# Altium schematic sheet Adafruit PyGamer_1.SchDoc
size 442 x 288 mm; COMPANY: ADAFRUIT INDUSTRIES; DRAWN: KTOWN; REV: B; Origin: Eagle
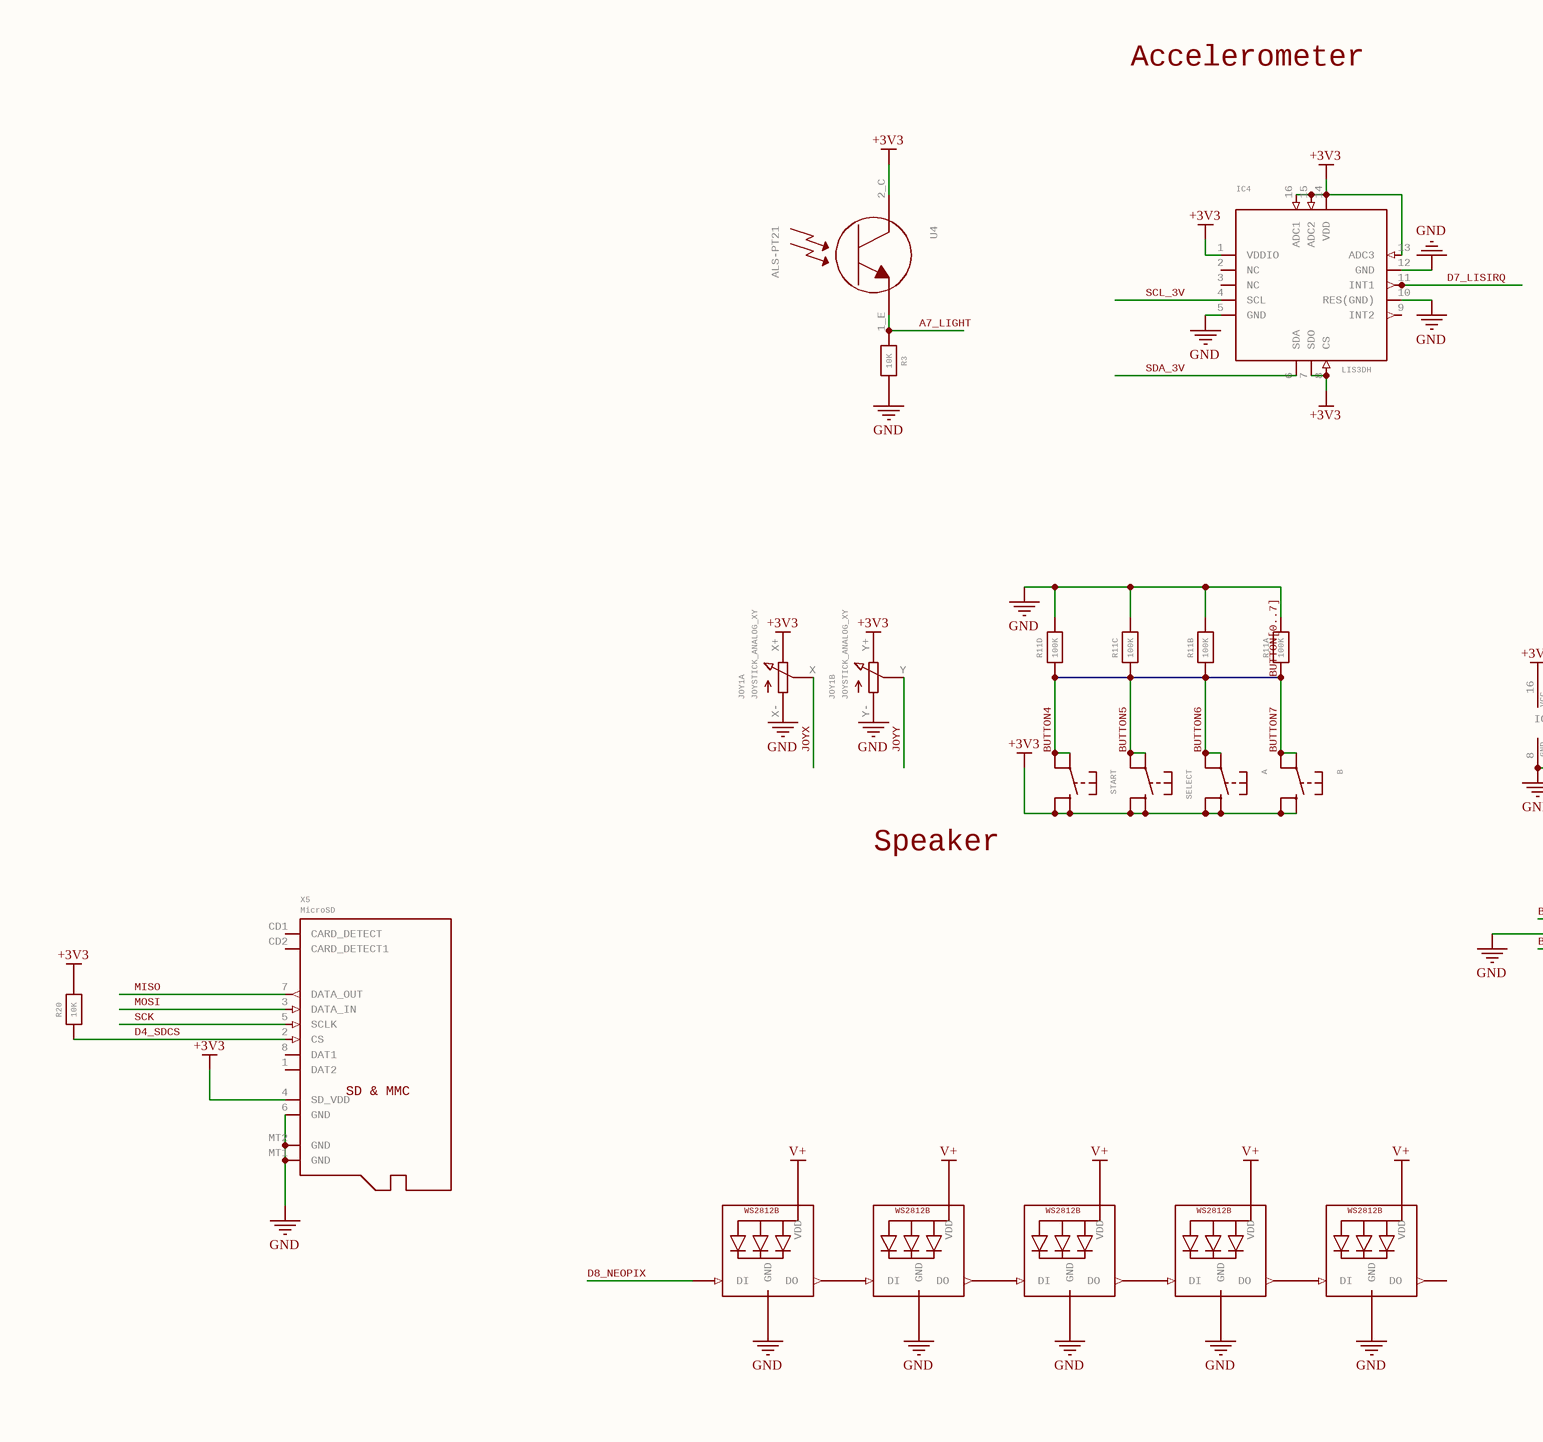
[diagram p0: Adafruit PyGamer_1.SchDoc, left]
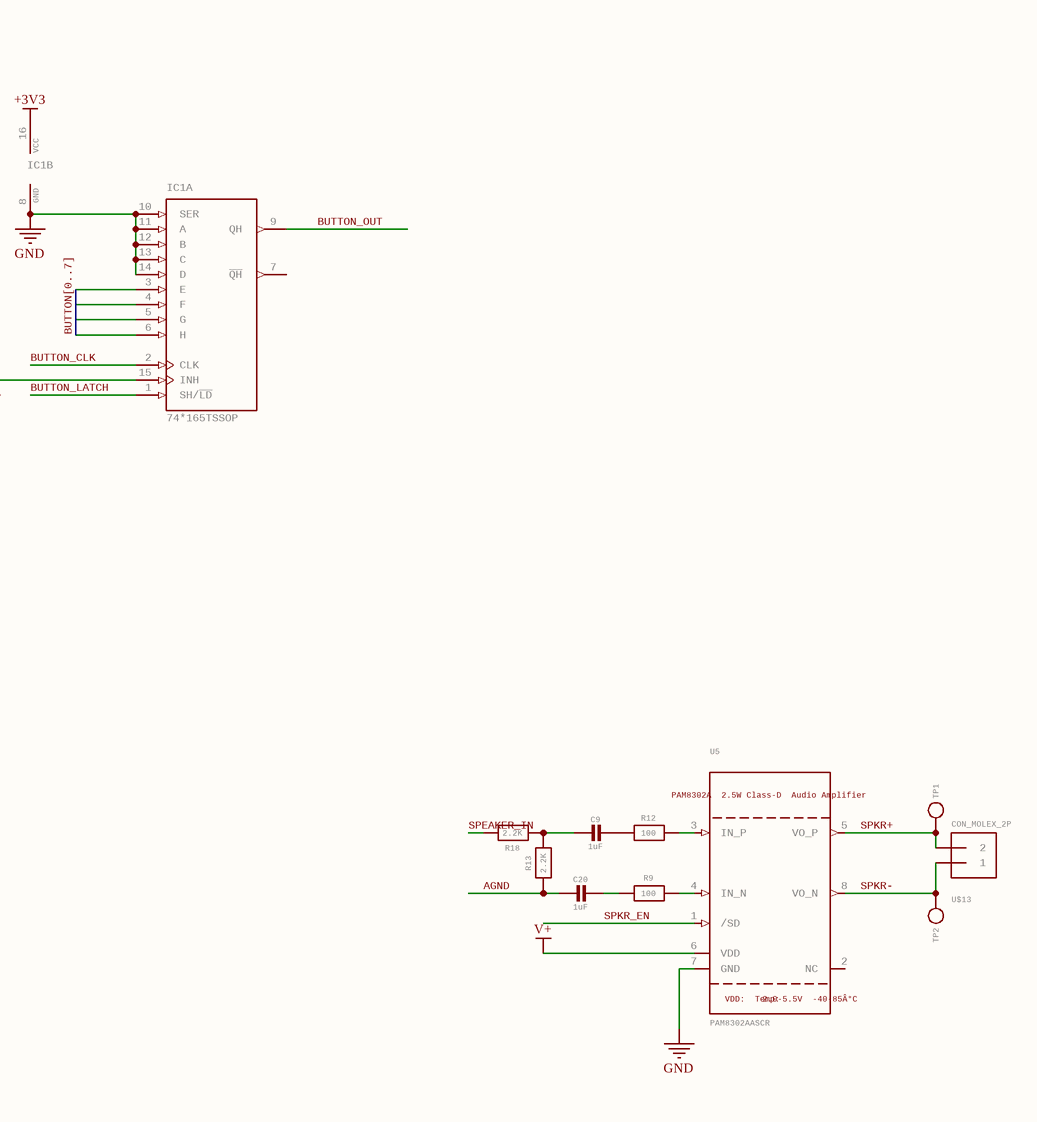
[diagram p1: Adafruit PyGamer_1.SchDoc, right]

## Parts
A  SWITCH_TACT_SMT_6MM8MMCAP  [6MM_SMT_6MMCAP]  (value not drawn)
B  SWITCH_TACT_SMT_6MM8MMCAP  [6MM_SMT_6MMCAP]  (value not drawn)
C9  1uF  [0603-NO]
C20  1uF  [0603-NO]
IC1  74*165TSSOP  [TSSOP16]  (parts A,B of 2)
IC4  LIS3DH  [LGA16_3X3MM]
JOY1  JOYSTICK_ANALOG_XY  [JOYSTICK_ANALOG_MINITHM]  (parts A,B of 2)
LED1  WS2812B3535  [LED3535]  (value not drawn)
LED2  WS2812B3535  [LED3535]  (value not drawn)
LED3  WS2812B3535  [LED3535]  (value not drawn)
LED4  WS2812B3535  [LED3535]  (value not drawn)
LED5  WS2812B3535  [LED3535]  (value not drawn)
R3  10K  [0603-NO]
R9  100  [0603-NO]
R11  100K  [RESPACK_4X0603]  (parts A,B,C,D of 4)
R12  100  [0603-NO]
R13  2.2K  [0603-NO]
R18  2.2K  [0603-NO]
R20  10K  [0603-NO]
SELECT  SWITCH_TACT_SMT_6MM8MMCAP  [6MM_SMT_6MMCAP]  (value not drawn)
START  SWITCH_TACT_SMT_6MM8MMCAP  [6MM_SMT_6MMCAP]  (value not drawn)
TP1  TESTPOINTROUND1.5MMNO  [TESTPOINT_ROUND_1.5MM_NO]  (value not drawn)
TP2  TESTPOINTROUND1.5MMNO  [TESTPOINT_ROUND_1.5MM_NO]  (value not drawn)
U4  ALS-PT21  [ALS-PT26-21C]
U5  PAM8302AASCR  PAM8302A
2.5WClass-D
AudioAmplifier: PAM8302A / 2.5W Class-D / Audio Amplifier  VDD:
Temp: VDD: / Temp:  2.0-5.5V
-40-85Â°C: 2.0-5.5V / -40-85Â°C  [MSOP8_0.65MM]
U$13  CON_MOLEX_2P  [53398-0271]
X5  MicroSD  SD&MMC: SD & MMC  [MICROSD]

## Nets
+3V3: A.B(S) A.B'(S1) B.B(S) B.B'(S1) IC1.16(VCC) IC4.1(VDDIO) IC4.7(SDO) IC4.8(CS) IC4.13(ADC3) IC4.14(VDD) IC4.15(ADC2) IC4.16(ADC1) JOY1.X+(E) JOY1.Y+(E) R20.2 SELECT.B(S) SELECT.B'(S1) START.B(S) START.B'(S1) U4.2_C(C) X5.4(SD_VDD)
GND: IC1.8(GND) IC1.10(SER) IC1.11(A) IC1.12(B) IC1.13(C) IC1.14(D) IC1.15(INH) IC4.5(GND) IC4.10(RES(GND)) IC4.12(GND) JOY1.X-(A) JOY1.Y-(A) LED1.4(GND) LED2.4(GND) LED3.4(GND) LED4.4(GND) LED5.4(GND) R3.1 R11.5 R11.6 R11.7 R11.8 U5.7(GND) X5.6(GND) X5.MT1(GND) X5.MT2(GND)
V+: LED1.2(VDD) LED2.2(VDD) LED3.2(VDD) LED4.2(VDD) LED5.2(VDD) U5.6(VDD)
A7_LIGHT: R3.2 U4.1_E(E)
AGND: C20.2 R13.1
BUTTON4: R11.4 START.A(P) START.A'(P1)
BUTTON5: R11.3 SELECT.A(P) SELECT.A'(P1)
BUTTON6: A.A(P) A.A'(P1) R11.2
BUTTON7: B.A(P) B.A'(P1) IC1.6(H) R11.1  [also labelled BUTTON[0..7]]
BUTTON_CLK: IC1.2(CLK)
BUTTON_LATCH: IC1.1(SH/~{LD})
BUTTON_OUT: IC1.9(QH)
D4_SDCS: R20.1 X5.2(CS)
D7_LISIRQ: IC4.11(INT1)
D8_NEOPIX: LED1.1(DI)
JOYX: JOY1.X(S)
JOYY: JOY1.Y(S)
MISO: X5.7(DATA_OUT)
MOSI: X5.3(DATA_IN)
SCK: X5.5(SCLK)
SCL_3V: IC4.4(SCL)
SDA_3V: IC4.6(SDA)
SPEAKER_IN: R18.2
SPKR+: TP1.P$1 U5.5(VO_P) U$13.2
SPKR-: TP2.P$1 U5.8(VO_N) U$13.1
SPKR_EN: U5.1(/SD)
NetC9_1: C9.1 R12.1
NetC9_2: C9.2 R13.2 R18.1
NetC20_1: C20.1 R9.1
NetLED1_3: LED1.3(DO) LED2.1(DI)
NetLED2_3: LED2.3(DO) LED3.1(DI)
NetLED3_3: LED3.3(DO) LED4.1(DI)
NetLED4_3: LED4.3(DO) LED5.1(DI)
NetR9_2: R9.2 U5.4(IN_N)
NetR12_2: R12.2 U5.3(IN_P)

Not connected (* = marked no-connect by the designer): IC1 3(E) 4(F) 5(G) 7(~{QH}); IC4 2(NC) 3(NC) 9(INT2); LED5 3(DO); U5 2(NC); X5 1(DAT2) 8(DAT1) CD1(CARD_DETECT) CD2(CARD_DETECT1)

## Notes on the sheet
- Accelerometer
- Speaker

## Library data of the parts
A B SELECT START = SWITCH_TACT_SMT_6MM8MMCAP: SMT Tact Switches 6x6mm - Digikey: P12940SCT-ND  KMR2 (4.6x2.8mm) - Digikey: 401-1426-1-ND  EVQ-PQHB55 - Light Touch, 160GF (4.5x4.5mm) - Digikey: P8090SCT-ND  KMT0 - KMT021 NGJ LHS (etc.) IP68/Waterproof - Digikey: CKN10289CT-ND; GateName_1: G$1; SymbolName_1: BUTTON_4PIN; DeviceName: _6MM8MMCAP; LibraryName: microbuilder; DeviceSetName: SWITCH_TACT_SMT
C9 C20 = CAP_CERAMIC0603_NO: Ceramic Capacitors   For new designs, use the packages preceded by an '_' character since they are more reliable:   The following footprints should be used on most boards: _0402 - Standard footprint for regular board layouts  _0603 - Standard footprint for regular board layouts  _0805 - Standard footprint for regular board layouts  _1206 - Standard footprint for regular board layouts       For extremely tight-pitch boards where space is at a premium, the following 'micro-pitch' footprints can be used (smaller pads, no silkscreen outline, etc.): _0402MP - Micro-pitch footprint for very dense/compact boards  _0603MP - Micro-pitch footprint for very dense/compact boards  _0805MP - Micro-pitch footprint for very dense/compact boards  _1206MP - Micro-pitch footprint for very dense/compact boards; GateName_1: G$1; SymbolName_1: CAPACITOR; DeviceName: 0603_NO; LibraryName: microbuilder; DeviceSetName: CAP_CERAMIC
IC1 = 74*165TSSOP: 8-bit parallel load SHIFT REGISTER; GateName_1: A; SymbolName_1: 74165; GateName_2: P; SymbolName_2: PWRN; DeviceName: TSSOP; DeviceSetName: 74*165; LibraryName: microbuilder
IC4 = ACCEL_LIS3DHTR: LIS3DHTR 3-Axis Accelerometer with I2C/SPI Interface    VDD: 1.71-3.6V  VDDIO: 1.71-VDD+0.1V  Scale: +/-2g, 4g, 8g, 16g with 16--bit data output  Temp:: -40Â°C - 85Â°C       Mouser: 511-LIS3DHTR Digikey: 497-10613-1-ND; GateName_1: G$1; SymbolName_1: LIS3DHTR; LibraryName: microbuilder; DeviceSetName: ACCEL_LIS3DHTR
JOY1 = JOYSTICK_ANALOG_XY: GateName_1: 1; SymbolName_1: POTENTIOMETER; GateName_2: 2; SymbolName_2: POTENTIOMETER; LibraryName: microbuilder; DeviceSetName: JOYSTICK_ANALOG_XY
LED1-LED5 = WS2812B3535: GateName_1: G$1; SymbolName_1: WS2812BLED; DeviceName: 3535; LibraryName: microbuilder; DeviceSetName: WS2812B; WS2812B: WS2812B
R3 R9 R12 R13 R18 R20 = RESISTOR_0603_NOOUT: Resistors   For new designs, use the packages preceded by an '_' character since they are more reliable:   The following footprints should be used on most boards: _0402 - Standard footprint for regular board layouts  _0603 - Standard footprint for regular board layouts  _0805 - Standard footprint for regular board layouts  _1206 - Standard footprint for regular board layouts       For extremely tight-pitch boards where space is at a premium, the following 'micro-pitch' footprints can be used (smaller pads, no silkscreen outline, etc.): _0402MP - Micro-pitch footprint for very dense/compact boards  _0603MP - Micro-pitch footprint for very dense/compact boards  _0805MP - Micro-pitch footprint for very dense/compact boards  _1206MP - Micro-pitch footprint for very dense/compact boards; GateName_1: G$1; SymbolName_1: RESISTOR; DeviceName: _0603_NOOUT; LibraryName: microbuilder; DeviceSetName: RESISTOR
R11 = RESISTOR_4PACK: Resistor Packs (4 resistors)   4 x 0603 10K 1/16W - Digikey: YC164J-10KCT-ND; GateName_1: G$1; GateName_2: G$2; GateName_3: G$3; GateName_4: G$4; SymbolName_1: RESISTOR; SymbolName_2: RESISTOR; SymbolName_3: RESISTOR; SymbolName_4: RESISTOR; LibraryName: microbuilder; DeviceSetName: RESISTOR_4PACK
TP1 TP2 = TESTPOINTROUND1.5MMNO: Test Point   Various test points for characterisation and PCB testing    TESTPOINT_SMT - Compact Surface Mount Test Point [Digikey: 5016KTR-ND]; GateName_1: G$1; SymbolName_1: TESTPOINT; DeviceName: ROUND1.5MMNO; LibraryName: microbuilder; DeviceSetName: TESTPOINT
U4 = PHOTOTRANSISTOR_PT26-21C: ALS-PT19-315C - Analog Light Sensor   VCC: 2.5-5.5V; GateName_1: G$1; SymbolName_1: ALS-PT19-315C; DeviceName: _PT26-21C; LibraryName: microbuilder; DeviceSetName: PHOTOTRANSISTOR
U5 = AUDIOAMP_PAM8302A: PAM8302A - 2.5W Class-D Mono Audio Amplifier    MSOP8 = PAM8302AASCR; GateName_1: G$1; SymbolName_1: PAM8302A; LibraryName: microbuilder; DeviceSetName: AUDIOAMP_PAM8302A
U$13 = CON_MOLEX_2P: GateName_1: G$1; SymbolName_1: 1X2; LibraryName: microbuilder; DeviceSetName: CON_MOLEX_2P
X5 = MICROSD: MicroSD/Transflash Card Holder with SPI pinout   3M: 2908-05WB-MG 4UConnector: 19656   Footprint courtesy: Adafruit Industries; GateName_1: G$1; SymbolName_1: TRANSFLASH; LibraryName: microbuilder; DeviceSetName: MICROSD